# EAGLE schematic aa (EAGLE 9.6.2)
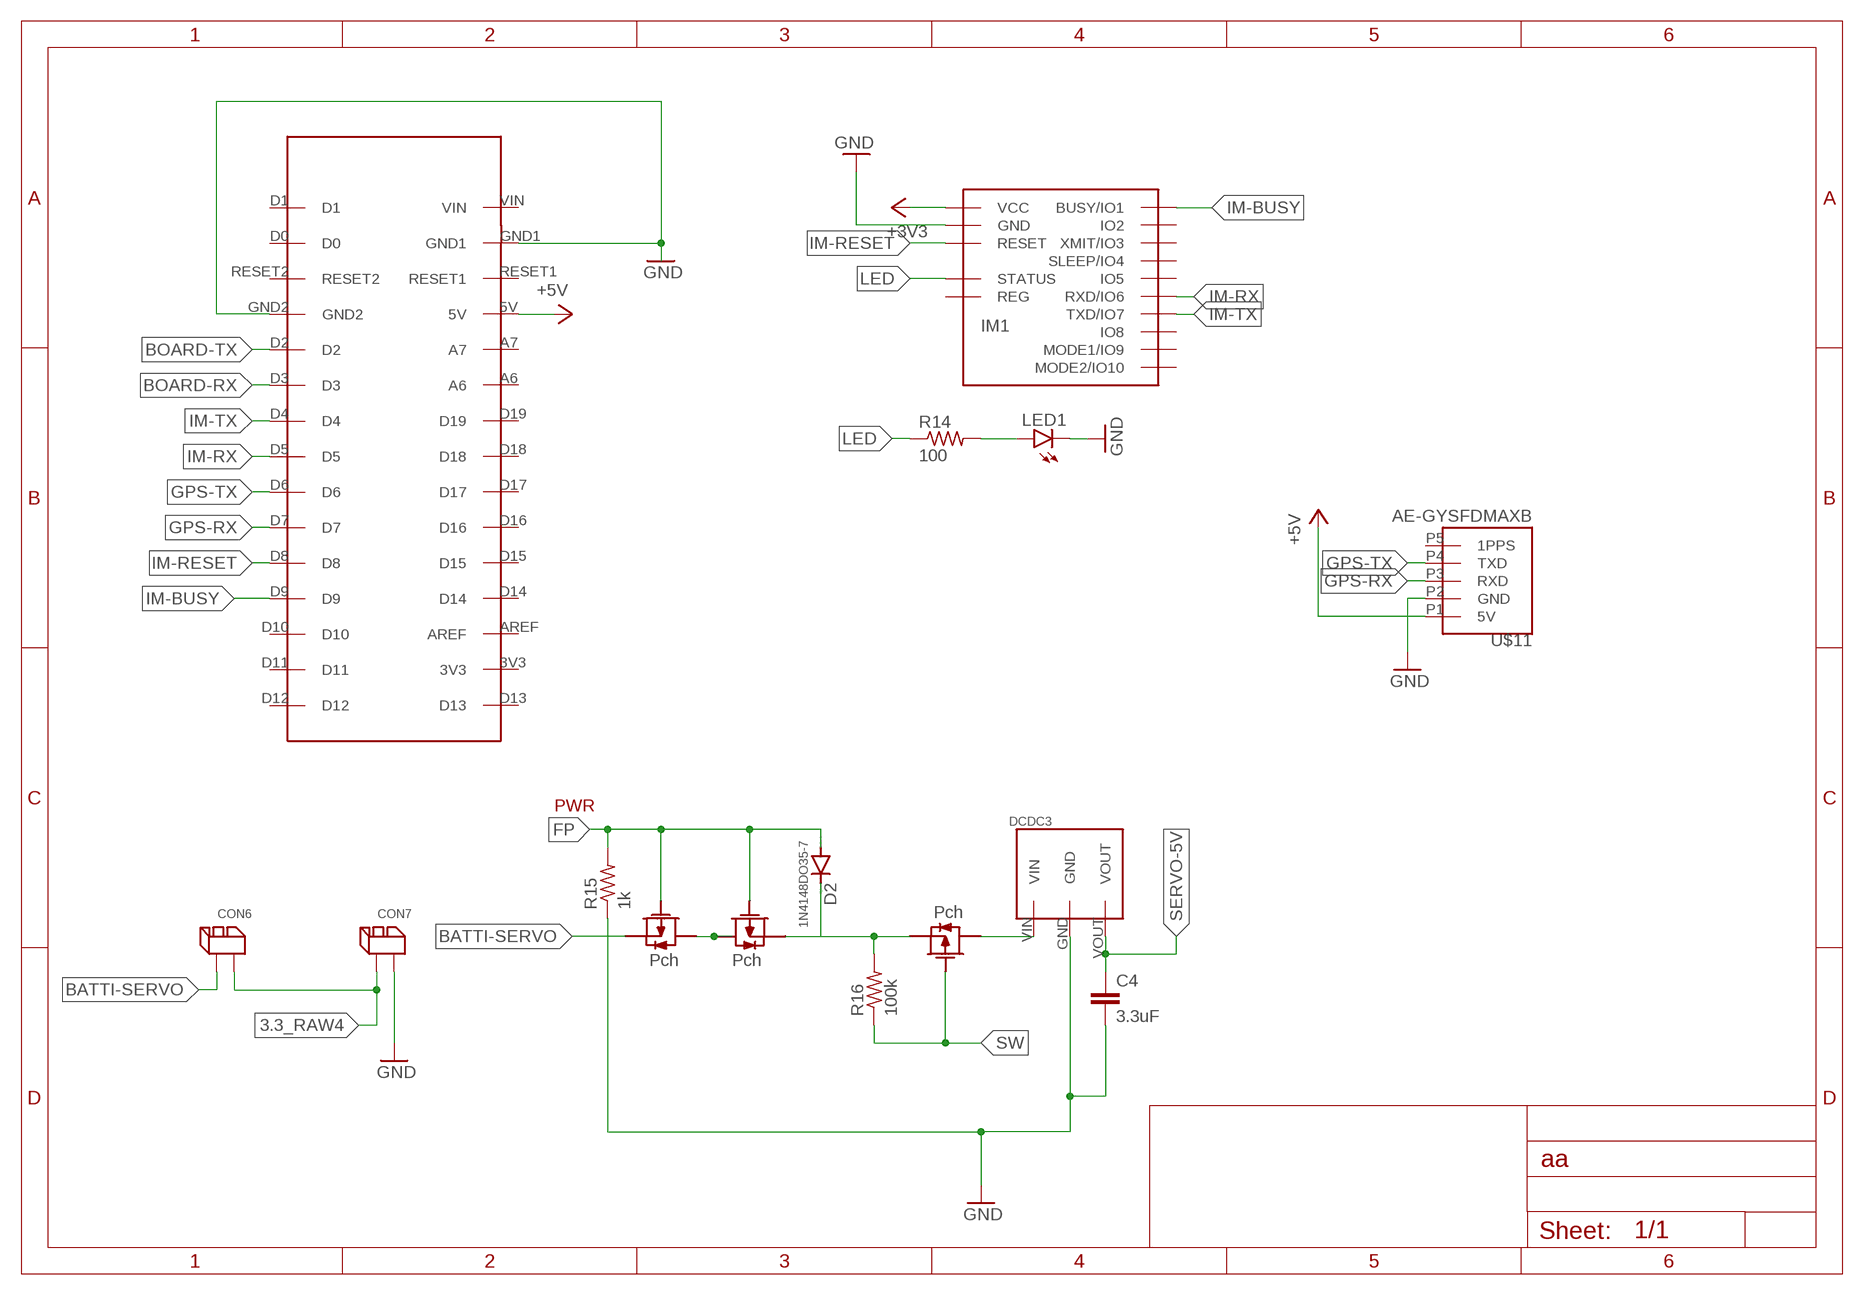
[diagram p0: schematic, sheet 1]

## Parts
C4  3.3uF  C-EU025-024X044  [C025-024X044]
CON6  2PIN  [2PIN]
CON7  2PIN  [2PIN]
D2  1N4148DO35-7  [DO35-7]
DCDC3  5V1A_M78AR05-1  [5V1A_M78AR05-1]
IM1  IM920_IM920C  [IM920_IM920C]
LED1  LED5MM  [LED5MM]
R14  100  R-US_0204/7  [0204/7]
R15  1k  R-US_0204/7  [0204/7]
R16  100k  R-US_0204/7  [0204/7]
U$7  ARDUINONANO  [ARDUINONANO]
U$8  2SJ681-PCH  [2SJ681]
U$9  2SJ681-PCH  [2SJ681]
U$10  2SJ681-PCH  [2SJ681]
U$11  AE-GYSFDMAXB  [AE-GYSFDMAXB]

## Nets
3.3_RAW4: CON6.P$1 CON7.P$2
+3V3: IM1.$P17(VCC)
+5V: U$7.5V U$11.P1(5V)
BATTI-SERVO: CON6.P$2 U$8.SOURCE
BOARD-RX: U$7.D3
BOARD-TX: U$7.D2
FP: D2.A R15.2 U$8.GATE U$10.GATE
GND: C4.2 CON7.P$1 DCDC3.GND IM1.$P18(GND) LED1.K(C) R15.1 U$7.GND1 U$7.GND2 U$11.P2(GND)
GPS-RX: U$7.D7 U$11.P3(RXD)
GPS-TX: U$7.D6 U$11.P4(TXD)
IM-BUSY: IM1.$P1(BUSY/IO1) U$7.D9
IM-RESET: IM1.$P19(RESET) U$7.D8
IM-RX: IM1.$P6(RXD/IO6) U$7.D5
IM-TX: IM1.$P7(TXD/IO7) U$7.D4
LED: IM1.$P15(STATUS) R14.1
N$4: D2.C R16.2 U$9.SOURCE U$10.SOURCE
N$5: U$8.DRAIN U$10.DRAIN
N$6: LED1.A R14.2
N$8: DCDC3.VIN U$9.DRAIN
SERVO-5V: C4.1 DCDC3.VOUT
SW: R16.1 U$9.GATE
Unconnected: IM1.$P2(IO2) IM1.$P3(XMIT/IO3) IM1.$P4(SLEEP/IO4) IM1.$P5(IO5) IM1.$P8(IO8) IM1.$P9(MODE1/IO9) IM1.$P10(MODE2/IO10) IM1.$P16(REG) U$7.3V3 U$7.A6 U$7.A7 U$7.AREF U$7.D0 U$7.D1 U$7.D10 U$7.D11 U$7.D12 U$7.D13 U$7.D14 U$7.D15 U$7.D16 U$7.D17 U$7.D18 U$7.D19 U$7.RESET1 U$7.RESET2 U$7.VIN U$11.P5(1PPS)

## Notes on the sheet
- PWR

## Library data of the parts
C4 = rcl:C-EU: CAPACITOR, European symbol; SPICEPREFIX: C
CON6 CON7 = XR Connector:2PIN
D2 = diode:1N4148: DIODE high speed (Philips)
DCDC3 = DC-DC:5V1A_M78AR05-1
IM1 = CANSAT12th:IM920_IM920C
LED1 = led:LED: LED OSRAM: - CHIPLED LG R971, LG N971, LY N971, LG Q971, LY Q971, LO R971, LY R971 LH N974, LH R974 LS Q976, LO Q976, LY Q976 LO Q996 - Hyper CHIPLED LW Q18S LB Q993, LB Q99A, LB R99A - SideLED LS A670, LO A670, LY A670, LG A670, LP A670 LB A673, LV A673, LT A673, LW A673 LH A674 LY A675 LS A676, LA A676, LO A676, LY A676, LW A676 LS A679, LY A679, LG A679 - Hyper Micro SIDELED® LS Y876, LA Y876, LO Y876, LY Y876 LT Y87S - SmartLED LW L88C, LW L88S LB L89C, LB L89S, LG L890 LS L89K, LO L89K, LY L89K LS L896, LA L896, LO L896, LY L896 - TOPLED LS T670, LO T670, LY T670, LG T670, LP T670 LSG T670, LSP T670, LSY T670, LOP T670, LYG T670 LG T671, LOG T671, LSG T671 LB T673, LV T673, LT T673, LW T673 LH T674 LS T676, LA T676, LO T676, LY T676, LB T676, LH T676, LSB T676, LW T676 LB T67C, LV T67C, LT T67C, LS T67K, LO T67K, LY T67K, LW E67C LS E67B, LA E67B, LO E67B, LY E67B, LB E67C, LV E67C, LT E67C LW T67C LS T679, LY T679, LG T679 LS T770, LO T770, LY T770, LG T770, LP T770 LB T773, LV T773, LT T773, LW T773 LH T774 LS E675, LA E675, LY E675, LS T675 LS T776, LA T776, LO T776, LY T776, LB T776 LHGB T686 LT T68C, LB T68C - Hyper Mini TOPLED® LB M676 - Mini TOPLED Santana® LG M470 LS M47K, LO M47K, LY M47K Source: http://www.osram.convergy.de LUXEON: - LUMILED® LXK2-PW12-R00, LXK2-PW12-S00, LXK2-PW14-U00, LXK2-PW14-V00 LXK2-PM12-R00, LXK2-PM12-S00, LXK2-PM14-U00 LXK2-PE12-Q00, LXK2-PE12-R00, LXK2-PE12-S00, LXK2-PE14-T00, LXK2-PE14-U00 LXK2-PB12-K00, LXK2-PB12-L00, LXK2-PB12-M00, LXK2-PB14-N00, LXK2-PB14-P00, LXK2-PB14-Q00 LXK2-PR12-L00, LXK2-PR12-M00, LXK2-PR14-Q00, LXK2-PR14-R00 LXK2-PD12-Q00, LXK2-PD12-R00, LXK2-PD12-S00 LXK2-PH12-R00, LXK2-PH12-S00 LXK2-PL12-P00, LXK2-PL12-Q00, LXK2-PL12-R00 Source: www.luxeon.com KINGBRIGHT: KA-3528ASYC Source: www.kingbright.com
R14-R16 = rcl:R-US_: RESISTOR, American symbol; SPICEPREFIX: R
U$7 = arduinonano device:ARDUINONANO
U$8-U$10 = mosfet:2SJ681-PCH
U$11 = AE-GYSFDMAXB:AE-GYSFDMAXB

## Net classes
0 default: width 0.406 mm